# EAGLE design jlpcb-184 (EAGLE 7.3.0)
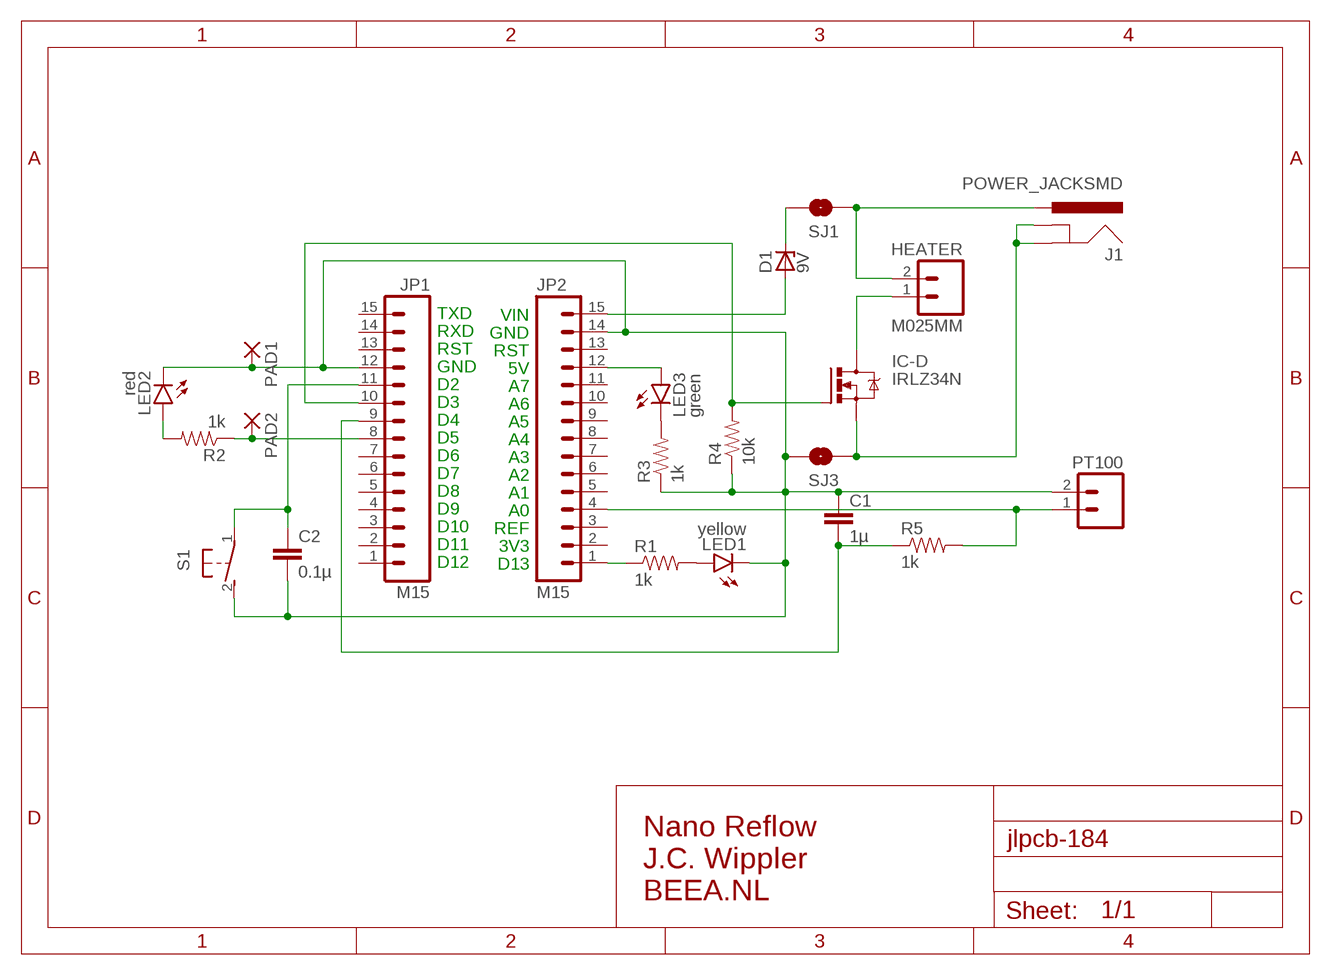
[diagram p0: schematic, sheet 1]

## Parts
C1  1µ  CAPPTH1  [CAP-PTH-5MM]
C2  0.1µ  CAPPTH  [CAP-PTH-SMALL]
D1  9V  ZENER-DIODEDO35Z10  [DO35Z10]
HEATER  M025MM  [SCREWTERMINAL-5MM-2]
IC-D  IRLZ34N  IRF540  [TO220BV]
J1  POWER_JACKSMD  [POWER_JACK_SMD]
JP1  M15  [1X15]
JP2  M15  [1X15]
LED1  yellow  LED3MM  [LED3MM]
LED2  red  LED3MM  [LED3MM]
LED3  green  LED3MM  [LED3MM]
PAD1  1,6/0,8  [1,6/0,8]
PAD2  1,6/0,8  [1,6/0,8]
PT100  M023.5MM  [SCREWTERMINAL-3.5MM-2]
R1  1k  RESISTORAXIAL-0.3  [AXIAL-0.3]
R2  1k  RESISTORAXIAL-0.3  [AXIAL-0.3]
R3  1k  RESISTORAXIAL-0.3  [AXIAL-0.3]
R4  10k  RESISTORAXIAL-0.3  [AXIAL-0.3]
R5  1k  RESISTORAXIAL-0.3  [AXIAL-0.3]
S1  31-XX  [B3F-31XX]
SJ1  SOLDERJUMPERTRACE  [SJ_2S-TRACE]
SJ3  SOLDERJUMPERTRACE  [SJ_2S-TRACE]

## Nets
N$1 [power]: D1.A JP2.15
N$2 [power]: D1.C SJ1.2
N$3 [current]: HEATER.1 IC-D.D
N$4 [current]: IC-D.S J1.GND(GNDBREAK) J1.P$4(GND) SJ3.1
N$5 [power]: C1.1 C2.2 JP1.12 JP2.14 LED1.K(C) LED2.K(C) PAD1.1(P) PT100.2 R3.P$1 R4.P$1 S1.2(S) SJ3.2
N$6 [current]: HEATER.2 J1.VIN0(PWR) SJ1.1
N$7: LED2.A R2.P$2
N$8: LED1.A R1.P$2
N$9: JP2.1 R1.P$1
N$10: JP2.4 PT100.1 R5.P$2
N$11: LED3.K(C) R3.P$2
N$12: JP2.12 LED3.A
N$13: IC-D.G JP1.10 R4.P$2
N$15: JP1.8 PAD2.1(P) R2.P$1
N$16 [power]: C1.2 JP1.9 R5.P$1
N$17: C2.1 JP1.11 S1.1(P)
Unconnected: JP1.1 JP1.2 JP1.3 JP1.4 JP1.5 JP1.6 JP1.7 JP1.13 JP1.14 JP1.15 JP2.2 JP2.3 JP2.5 JP2.6 JP2.7 JP2.8 JP2.9 JP2.10 JP2.11 JP2.13

## Notes on the sheet
- VIN
- TXD
- GND
- RXD
- RST
- RST
- 5V
- GND
- A7
- D2
- A6
- D3
- A5
- D4
- A4
- D5
- A3
- D6
- A2
- D7
- A1
- D8
- A0
- D9
- REF
- D10
- 3V3
- D11
- D13
- D12
- Nano Reflow
  J.C. Wippler
  BEEA.NL

## Library data of the parts
C1 C2 = SparkFun-Capacitors:CAP: Capacitor Standard 0603 ceramic capacitor, and 0.1" leaded capacitor.
D1 = diode:ZENER-DIODE: Z-Diode
HEATER = SparkFun-Connectors:M02: Standard 2-pin 0.1" header. Use with - straight break away headers ( PRT-00116) - right angle break away headers (PRT-00553) - swiss pins (PRT-00743) - machine pins (PRT-00117) - female headers (PRT-00115) Molex polarized connector foot print use with: PRT-08233 with associated crimp pins and housings. 2.54_SCREWTERM for use with PRT-10571. 3.5mm Screw Terminal footprints for PRT-08084 5mm Screw Terminal footprints for use with PRT-08432; STOREFRONT_ID: PRT-08432
IC-D = transistor-power:IRF540: HEXFET Power MOSFET
J1 = SparkFun:POWER_JACK: Power Jack This is the standard 5.5mm barrel jack for power. The PTH is the most common, proven, reliable, footprint. All others are experimental. The Slot footprint only works if the mill layer is transmitted to the PCB fab house so be warned. Spark Fun Electronics SKU : PRT-00119. Mating wall wart : TOL-00298 (and others)
JP1 JP2 = SparkFun-Connectors:M15: Header 15 Standard 15-pin 0.1" header. Use with straight break away headers (SKU : PRT-00116), right angle break away headers (PRT-00553), swiss pins (PRT-00743), machine pins (PRT-00117), and female headers (PRT-00115).
LED1-LED3 = SparkFun-LED:LED: LEDs Standard schematic elements and footprints for 5mm, 3mm, 1206, and 0603 sized LEDs. 5mm - Spark Fun Electronics SKU : COM-00529 (and others)
PAD1 PAD2 = wirepad:1,6/0,8: THROUGH-HOLE PAD
PT100 = SparkFun-Connectors:M02: Standard 2-pin 0.1" header. Use with - straight break away headers ( PRT-00116) - right angle break away headers (PRT-00553) - swiss pins (PRT-00743) - machine pins (PRT-00117) - female headers (PRT-00115) Molex polarized connector foot print use with: PRT-08233 with associated crimp pins and housings. 2.54_SCREWTERM for use with PRT-10571. 3.5mm Screw Terminal footprints for PRT-08084 5mm Screw Terminal footprints for use with PRT-08432
R1-R5 = SparkFun-Passives:RESISTOR: Resistor Basic schematic elements and footprints for 0603, 1206, and PTH resistors.
S1 = adafruit:31-XX: OMRON SWITCH Now with beefier pads!
SJ1 SJ3 = JeeLabs:SOLDERJUMPER: Solder Jumper Standard SMD solder jumper. Used to automate production. Two varients : Normally Open and Normally Closed are the same, but have different paste layers. NC will have a large amount of paste and should jumper during reflow.

## Net classes
0 default: width 0.203 mm, clearance 0.203 mm
1 power: width 0.305 mm, clearance 0.203 mm
2 current: width 1.5 mm, clearance 0.305 mm

## Board
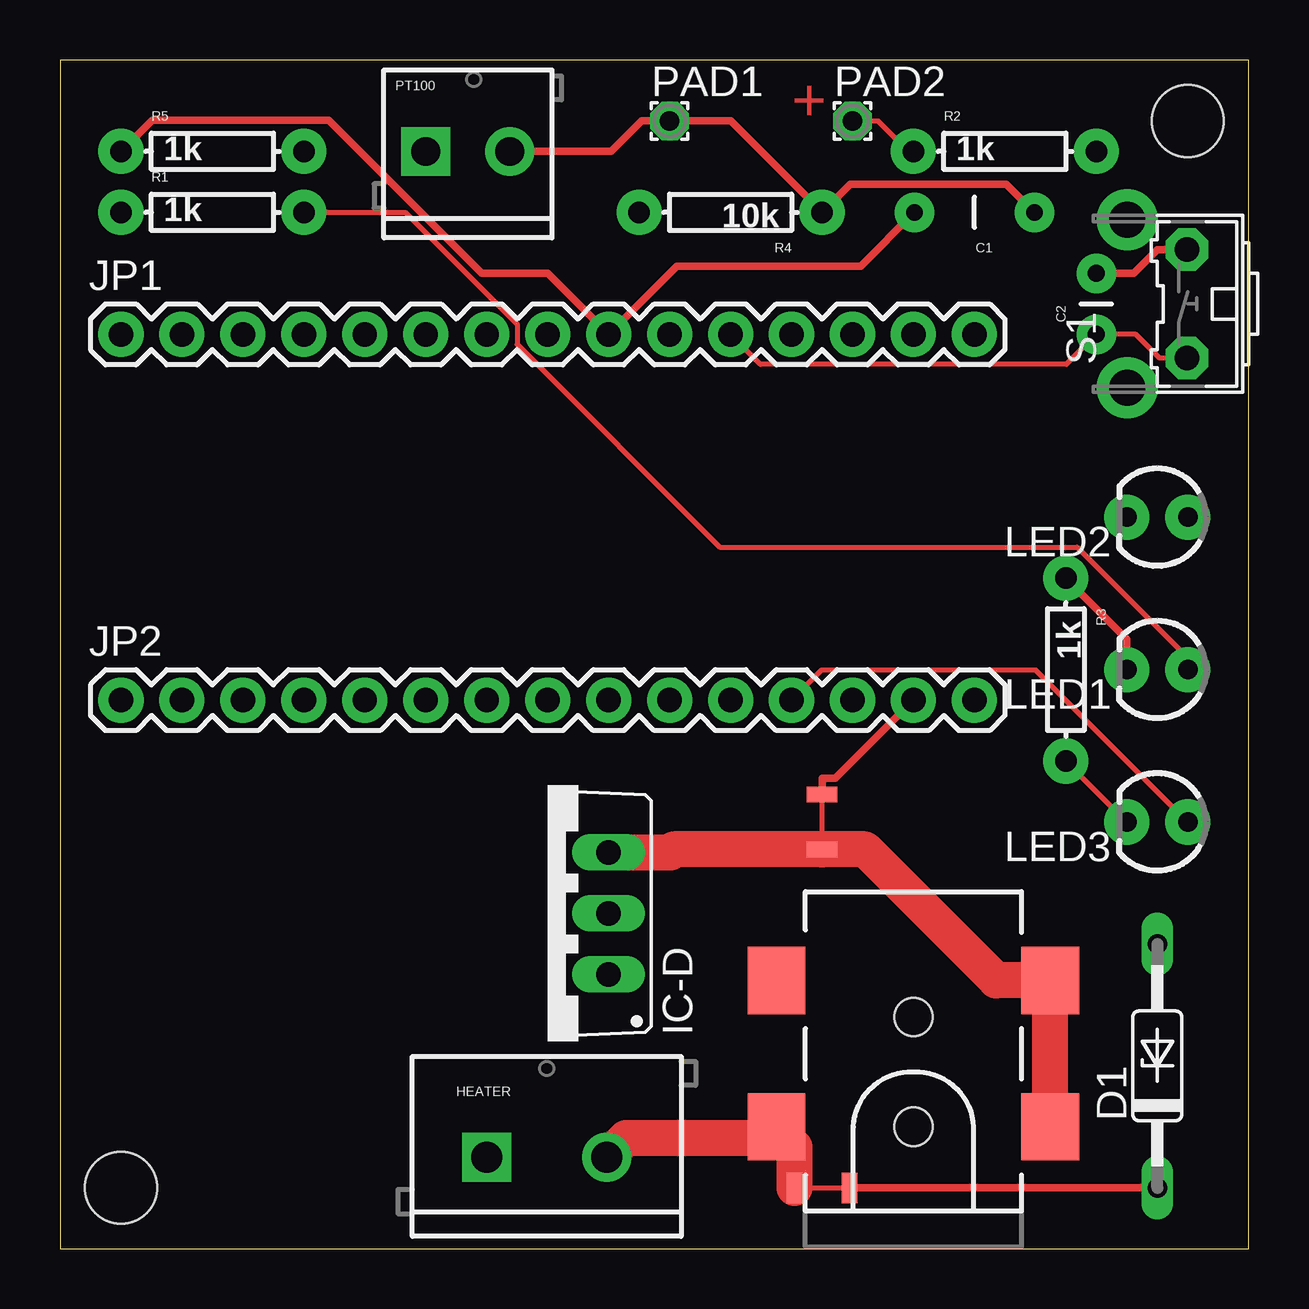
[diagram p1: board, top side]
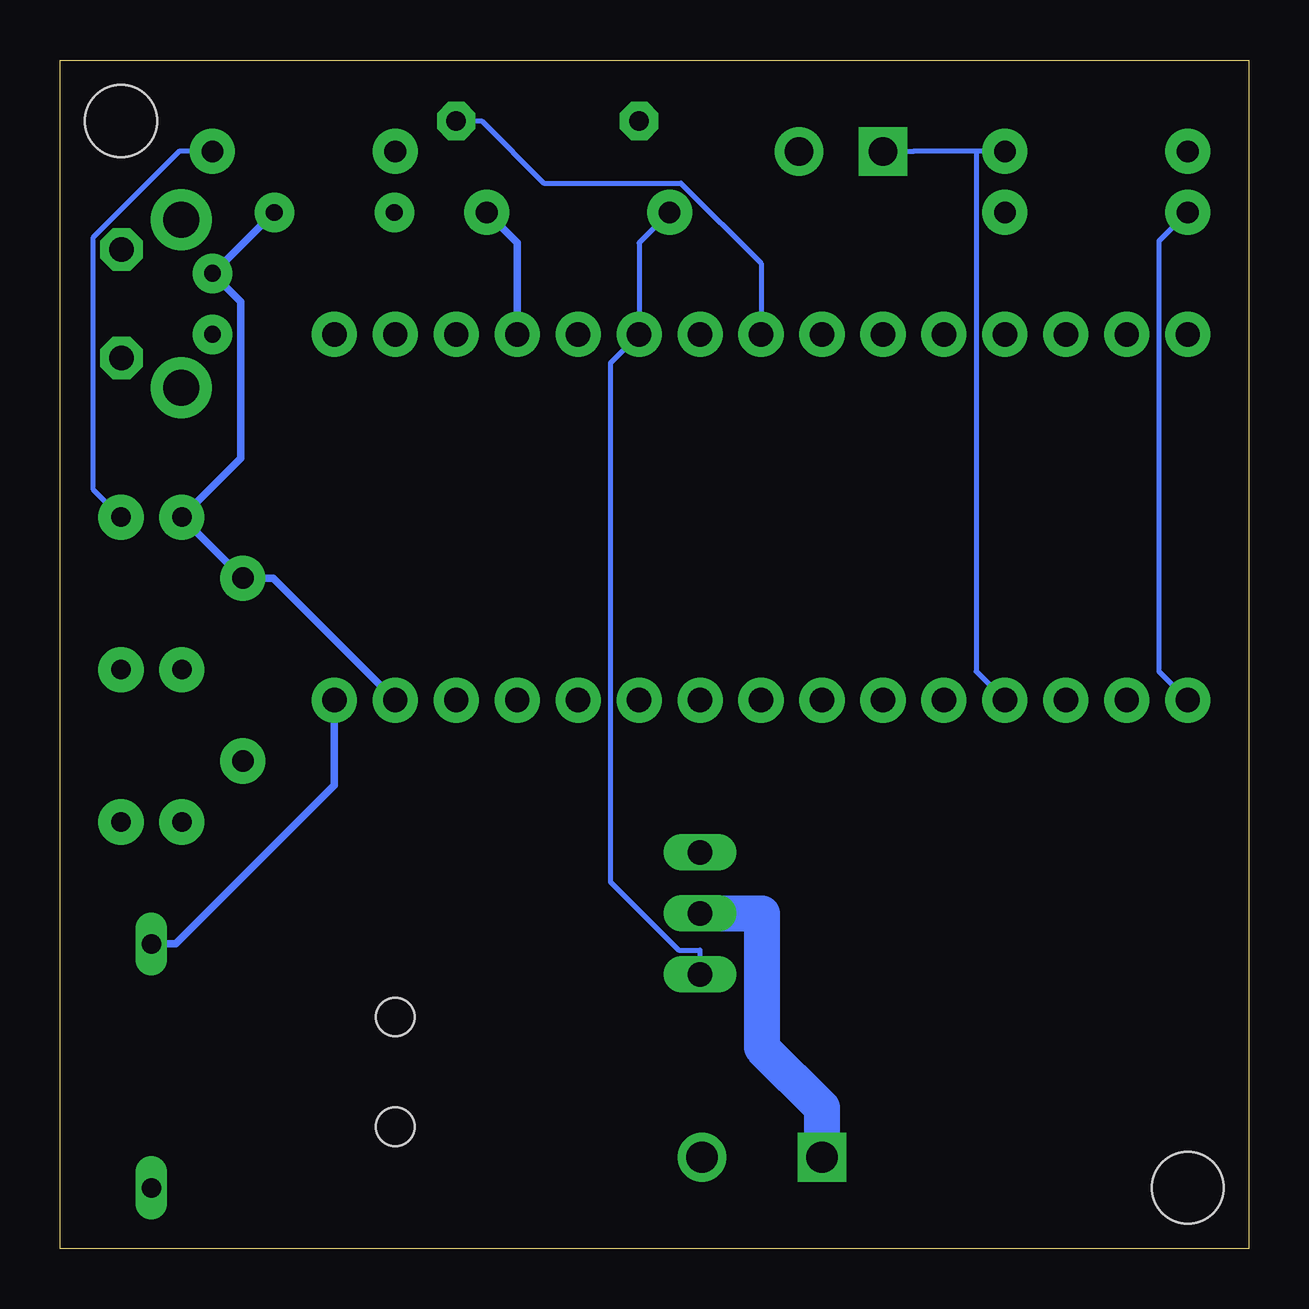
[diagram p2: board, bottom side, seen from below]

Size 49.53 x 49.53 mm. Coordinates in mm from the lower left corner, seen from the top.
Outline: 0,0 49.53,0 49.53,49.53 0,49.53 0,0
Copper layers (1*16): Top 0.035mm / dielectric 1.5mm / Bottom 0.035mm
Design rules "ITEADstudio_DRC": minimum track width 6mil, minimum drill 12mil, track to track 6mil, track to pad 6mil, pad to pad 6mil, via to via 6mil, smd to smd 0mil, copper to edge 10mil, drill to drill 10mil, minimum pad ring 10mil, minimum via ring 6mil, stop-mask expansion 2mil, vias tented up to drill 100mil, thermal gap 10mil
Holes 3 mm at 2.54,2.54 46.99,46.99

### Footprints (pad centres in the part's own frame; a part is rotated, then mirrored left to right if it is on the bottom)
CAP-PTH-5MM = drill 0.7 pad 1.651: 1 -2.5,0; 2 2.5,0
CAP-PTH-SMALL = drill 0.7 pad 1.651: 1 0,0; 2 2.54,0
DO35Z10 = drill 0.813 long: A 5.08,0; C -5.08,0
SCREWTERMINAL-5MM-2 = drill 1.3 pad 2.032 square: 1 0,0 | drill 1.3 pad 2.032: 2 5,0
TO220BV = drill 1.016 long: D 0,-2.54; G -2.54,-2.54; S 2.54,-2.54
POWER_JACK_SMD = smd 2.8 x 2.4: GND 0,-5.7; P$4 6.1,-5.7; VIN0 0,5.7; VIN1 6.1,5.7 | hole 1.6: 0,0; 4.572,0
1X15 = drill 1.016 pad 1.88: 1 0,0; 2 2.54,0; 3 5.08,0; 4 7.62,0; 5 10.16,0; 6 12.7,0; 7 15.24,0; 8 17.78,0; 9 20.32,0; 10 22.86,0; 11 25.4,0; 12 27.94,0; 13 30.48,0; 14 33.02,0; 15 35.56,0
LED3MM = drill 0.813 pad 1.88: A -1.27,0; K 1.27,0
1,6/0,8 = drill 0.813 pad 1.6 octagon: 1 0,0
SCREWTERMINAL-3.5MM-2 = drill 1.2 pad 2.032 square: 1 0,0 | drill 1.2 pad 2.032: 2 3.5,0
AXIAL-0.3 = drill 0.9 pad 1.88: P$1 -3.81,0; P$2 3.81,0
B3F-31XX = drill 1.016 pad 1.778 octagon: 1 -2.261,-1.245; 2 2.261,-1.245 | drill 1.499 pad 2.54: 3 -3.505,1.245; 4 3.505,1.245
SJ_2S-TRACE = smd 0.635 x 1.27: 1 -1.143,0; 2 1.143,0

### Placement (x,y rotation side)
C1  38.1,43.18 180 top
C2  43.18,38.1 90 top
D1  45.72,7.62 90 top
HEATER  17.78,3.81 0 top
IC-D  20.32,13.97 90 top
J1  35.56,5.08 90 top
JP1  2.54,38.1 0 top
JP2  2.54,22.86 0 top
LED1  45.72,24.13 180 top
LED2  45.72,30.48 180 top
LED3  45.72,17.78 180 top
PAD1  25.4,46.99 0 top
PAD2  33.02,46.99 0 top
PT100  15.24,45.72 0 top
R1  6.35,43.18 0 top
R2  39.37,45.72 0 top
R3  41.91,24.13 270 top
R4  27.94,43.18 180 top
R5  6.35,45.72 0 top
S1  45.72,39.37 90 top
SJ1  31.75,2.54 0 top
SJ3  31.75,17.78 90 top

### Tracks (layer width: path | path; a pad name or v marks a point on that pad's centre or on a via)
N$1
  Bottom 0.305: D1.A 44.7,12.7 38.1,19.3 JP2.15
N$2
  Top 0.305: SJ1.2 D1.C
N$3
  Bottom 1.5: HEATER.1 17.78,5.88 20.28,8.38 20.28,13.97 IC-D.D
N$4
  Top 1.5: IC-D.S 25.44,16.51 25.57,16.64 SJ3.1 33.55,16.64 39.01,11.18 J1.P$4 J1.GND
N$5
  Top 0.305: R3.P$1 44.45,25.4 LED1.K | C1.1 39.42,44.36 32.93,44.36 R4.P$1 27.94,46.99 PAD1.1 24.24,46.99 22.97,45.72 PT100.2 | S1.2 45.72,41.63 44.73,40.64 C2.2 | SJ3.2 31.75,19.6 32.3,19.6 JP2.14
  Bottom 0.305: 43.16,40.62 C2.2 | 43.16,40.62 42,39.46 42,32.93 LED2.K R3.P$1 40.64,27.94 JP2.14 | 43.16,40.62 C1.1 | R4.P$1 30.48,41.91 JP1.12
N$6
  Top 1.5: 29.86,4.6 23.57,4.6 HEATER.2 | 29.86,4.6 30.23,4.6 30.61,4.23 SJ1.1 | 29.86,4.6 J1.VIN0
N$7
  Bottom 0.203: R2.P$2 44.56,45.72 48.16,42.12 48.16,31.65 LED2.A
N$8
  Top 0.203: R1.P$2 14.39,43.18 19.05,38.52 19.05,37.68 27.49,29.23 42.38,29.23 46.99,24.63 LED1.A
N$9
  Bottom 0.203: R1.P$1 3.74,41.98 3.74,24.06 JP2.1
N$10
  Bottom 0.203: 11.36,45.72 13.97,45.72 PT100.1 | R5.P$2 11.36,45.72 | 11.36,45.72 11.36,24.06 JP2.4
N$11
  Top 0.203: R3.P$2 LED3.K
N$12
  Top 0.203: LED3.A 40.66,24.11 31.73,24.11 JP2.12
N$13
  Bottom 0.203: IC-D.G 22.86,12.45 23.76,12.45 26.6,15.29 26.6,36.9 JP1.10 25.4,41.91 R4.P$2
N$15
  Top 0.203: PAD2.1 34.07,46.99 35.34,45.72 R2.P$1
  Bottom 0.203: PAD2.1 31.97,46.99 29.38,44.4 23.66,44.4 20.32,41.06 JP1.8
N$16
  Top 0.305: R5.P$1 3.84,47.02 11.21,47.02 17.58,40.64 20.32,40.64 JP1.9 25.7,40.95 33.37,40.95 C1.2
N$17
  Top 0.203: JP1.11 29.19,36.85 41.93,36.85 C2.1 44.83,38.1 45.82,37.11 S1.1

### Text on the board
Top: +